# EasyEDA schematic SCH_3Electronic-Trash_2025-03-29.json
TITLE: Sheet_1; REV: 1.0; Date: 2024-07-19; Sheet: 1/1; Drawn By: sahilchess09; Company: Your Company
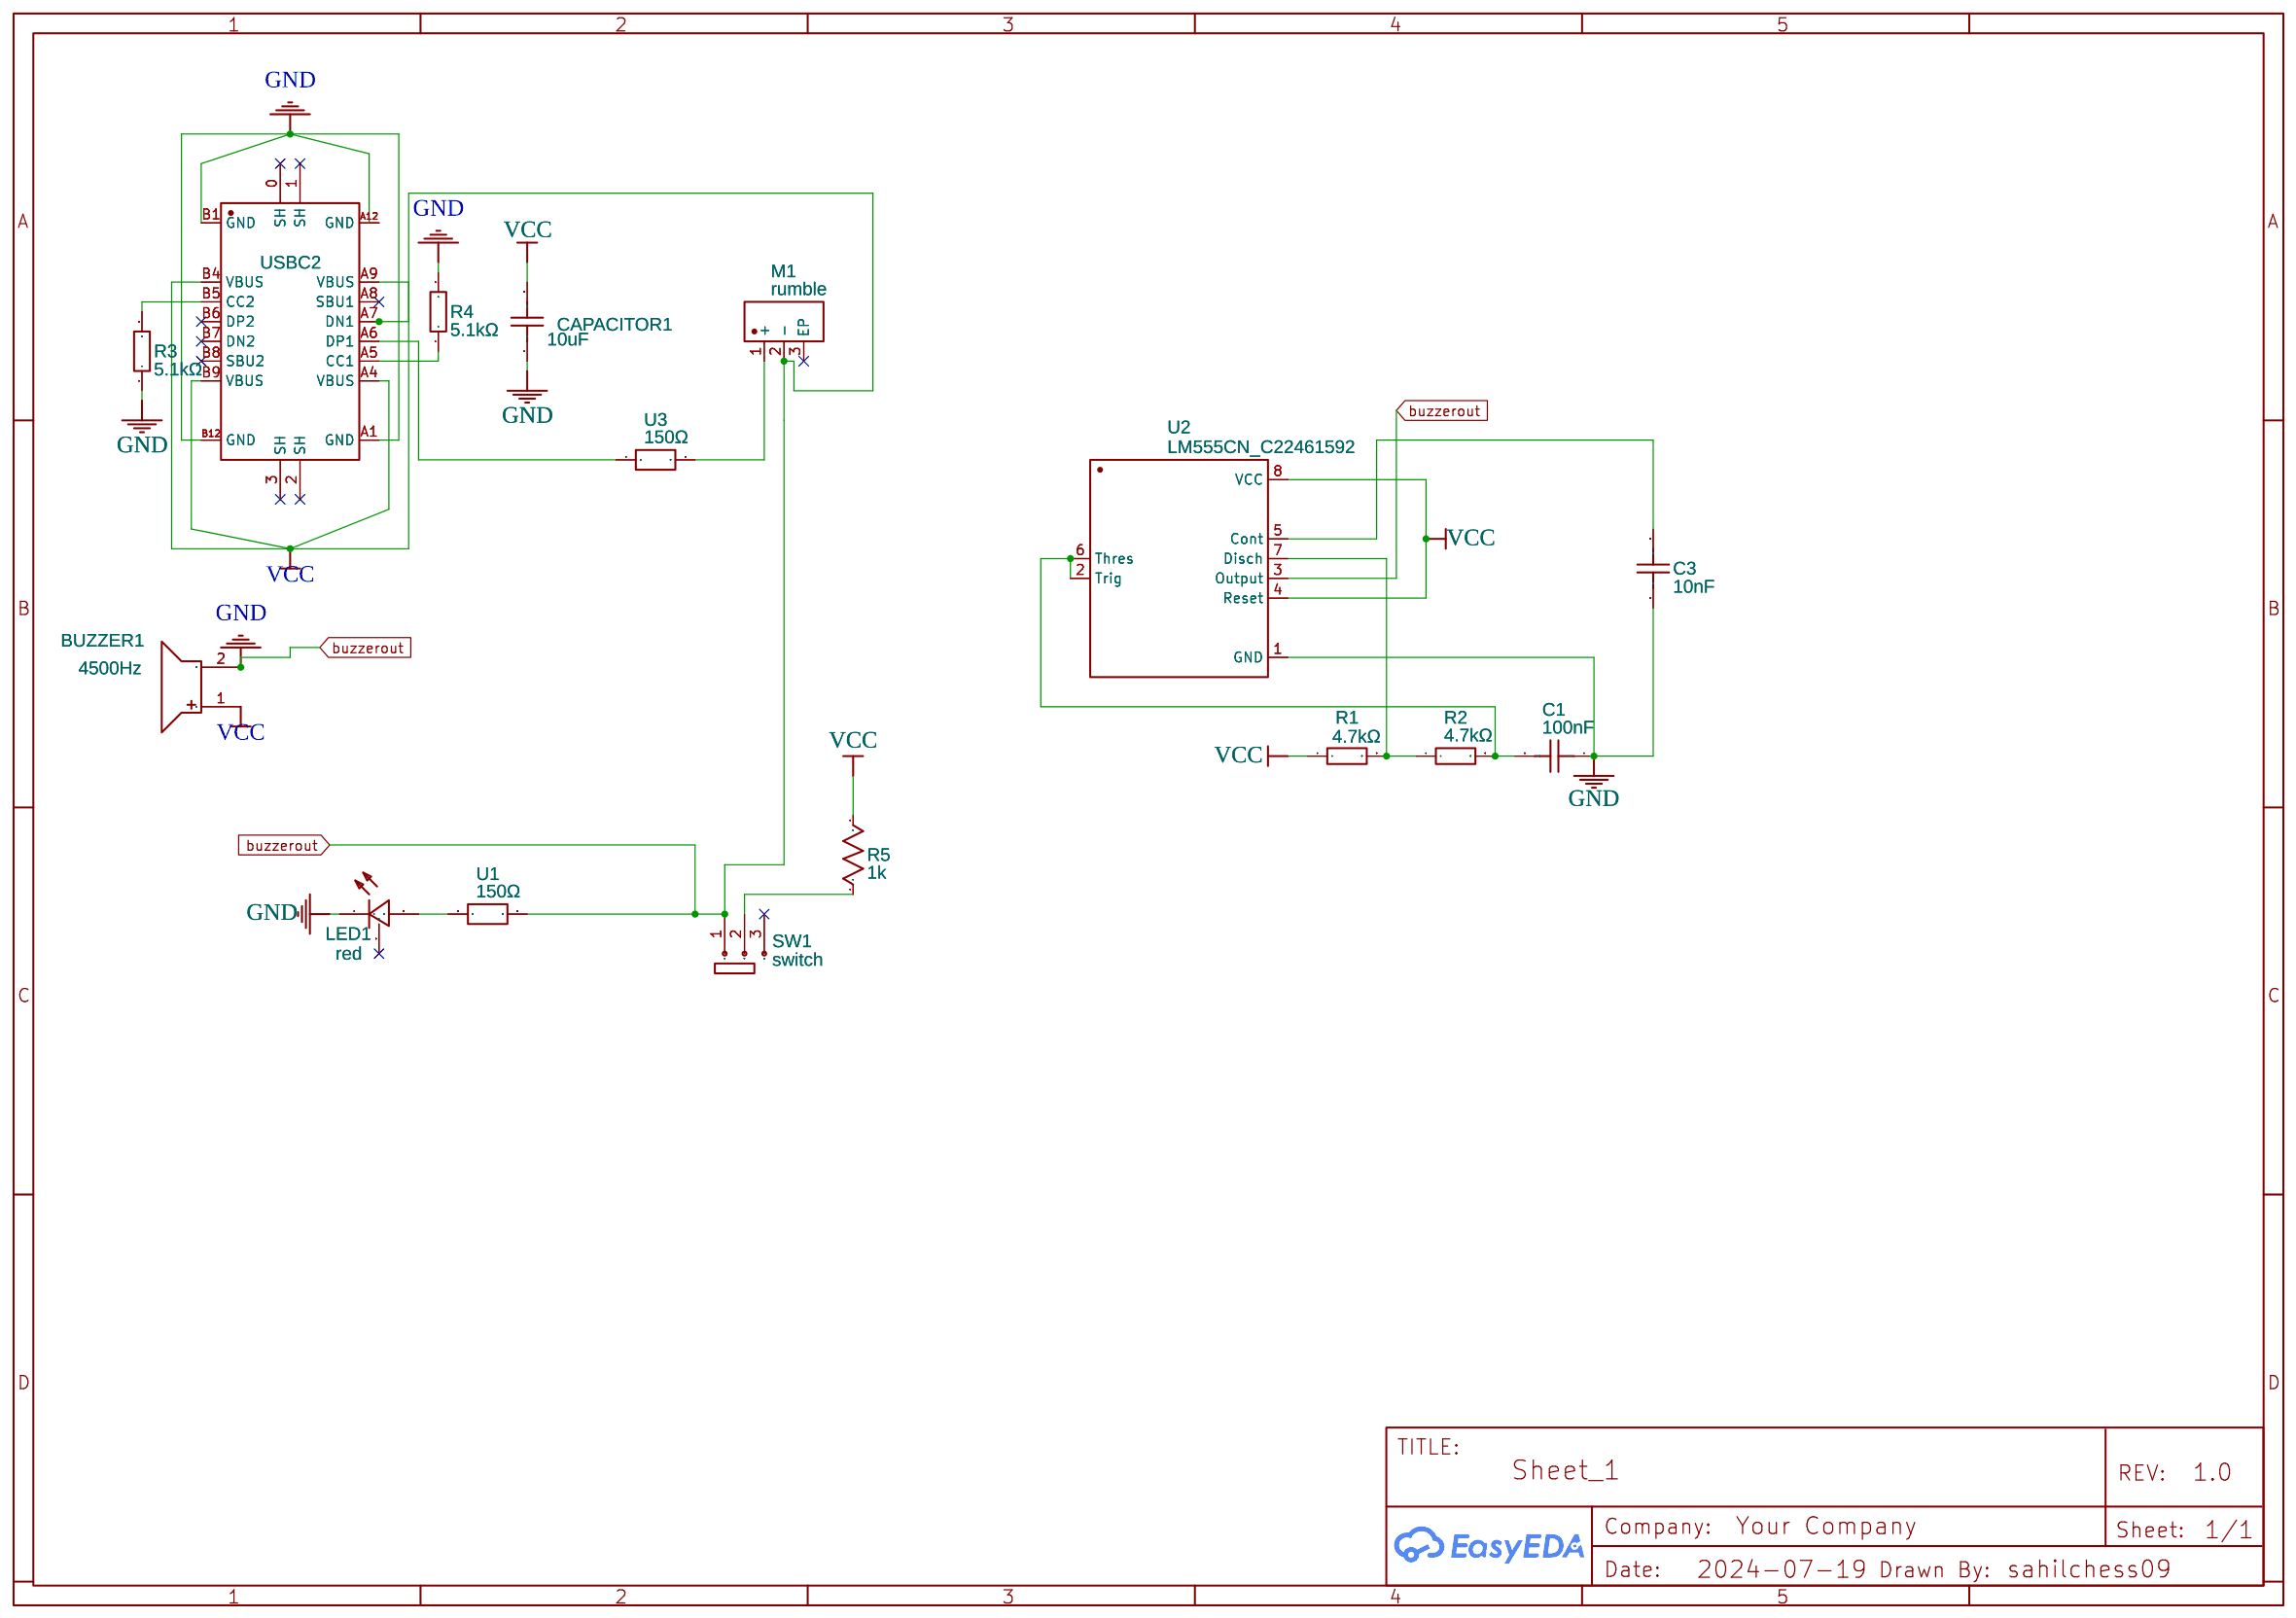
[diagram p0: schematic sheet]

## Parts
BUZZER1  4500Hz  [BUZ-TH_BD14.1-P7.62-D1.0-FD]
C1  100nF  [CAP-TH_L18.0-W6.0-P15.00-D0.8]
C3  10nF  [CAP-TH_L13.0-W5.0-P10.00-D0.6]
CAPACITOR1  10uF  [C0603]
LED1  red  [LED-SMD_3P-L3.2-W1.0-RD_RED]
M1  rumble  [VIBRATING-MOTOR-SMD_3P-C9900001680]
R1  4.7kΩ  [RES-TH_BD2.3-L6.5-P10.50-D0.5]
R2  4.7kΩ  [RES-TH_BD2.3-L6.5-P10.50-D0.5]
R3  5.1kΩ  [R0805]
R4  5.1kΩ  [R0805]
R5  1k  [R0603]
SW1  switch  [SW-TH_K3-1235S-L1]
U1  150Ω  [R0402]
U2  LM555CN_C22461592  [PDIP-8_L9.6-W6.4-P2.54-LS7.6-BL]
U3  150Ω  [R0402]
USBC2  TYPE-C-31-M-12  [USB-C_SMD-TYPE-C-31-M-12]

## Library data of the parts
BUZZER1 = HND-1407B: Contributor: LCSC; Supplier: LCSC; Manufacturer: 华能; Supplier Part: C115184; JLCPCB Part Class: Extended Part
C1 = MPX104K31D2KN15800: Contributor: lcsc; Supplier: LCSC; Supplier Part: C489085; Manufacturer: KNSCHA(科尼盛); JLCPCB Part Class: Extended Part
C3 = B1030630-D-10-3R: Contributor: lcsc; Supplier: LCSC; Supplier Part: C5119335; Manufacturer: GDHY(广东华裕)
CAPACITOR1 = CL10A106KP8NNNC: Supplier: LCSC; Manufacturer: SAMSUNG(三星); Supplier Part: C19702; JLCPCB Part Class: Basic Part
LED1 = TJ-S3210SW5TGLC2R-A5: Contributor: LCSC; Supplier: LCSC; Supplier Part: C273626; Manufacturer: TOGIALED(统佳); JLCPCB Part Class: Extended Part
M1 = Z3OC1T8219731: Contributor: LCSC; Supplier: LCSC; Supplier Part: C2894731; Manufacturer: KOTL(金龙机电); JLCPCB Part Class: Extended Part
R1 R2 = MF1/4W-4.7KΩ±1% T52: Contributor: LCSC; Supplier: LCSC; Supplier Part: C119339; Manufacturer: CCO(千志电子); Manufacturer Part: MF1/4W-4.7KΩ±1% T; JLCPCB Part Class: Extended Part
R3 R4 = RMC08055.1K1%N: Contributor: LCSC; Supplier: LCSC; Supplier Part: C269748; Manufacturer: Tyohm(幸亚电阻); JLCPCB Part Class: Extended Part
R5 = R_0603_US: Contributor: LCEDA_Lib
SW1 = K3-1235S-L1: Contributor: LCSC; Supplier: LCSC; Supplier Part: C223838; Manufacturer: 韩国韩荣; JLCPCB Part Class: Extended Part
U1 U3 = TNPW0402150RBYEP: Supplier: LCSC; Supplier Part: C4103204; Manufacturer: VISHAY(威世); JLCPCB Part Class: Extended Part; Contributor: lcsc
U2 = LM555CN_C22461592: Supplier: LCSC; Supplier Part: C22461592; Manufacturer: HGSEMI(华冠); Manufacturer Part: LM555CN; Contributor: lcsc
USBC2 = TYPE-C-31-M-12: Contributor: LCSC; Supplier: LCSC; Supplier Part: C165948; Manufacturer: 韩国韩荣; JLCPCB Part Class: Extended Part

## Nets
GND: BUZZER1.2 C1.1 C3.1 CAPACITOR1.1 LED1.1 M1.2(-) R3.1 R4.2 SW1.1 U1.2 U2.1(GND) U2.3(Output) USBC2.A1(GND) USBC2.A7(DN1) USBC2.A12(GND) USBC2.B1(GND) USBC2.B12(GND)
VCC: BUZZER1.1 CAPACITOR1.2 R1.1 R5.2 U2.4(Reset) U2.8(VCC) USBC2.A4(VBUS) USBC2.A9(VBUS) USBC2.B4(VBUS) USBC2.B9(VBUS)
Net-(C1-2): C1.2 R2.2 U2.2(Trig) U2.6(Thres)
Net-(C3-2): C3.2 U2.5(Cont)
Net-(LED1-2): LED1.2 U1.1
Net-(M1-1): M1.1(+) U3.2
Net-(R1-2): R1.2 R2.1 U2.7(Disch)
Net-(R3-2): R3.2 USBC2.B5(CC2)
Net-(R4-1): R4.1 USBC2.A5(CC1)
Net-(R5-1): R5.1 SW1.2
Net-(U3-1): U3.1 USBC2.A6(DP1)

Not connected (* = marked no-connect by the designer): LED1 3*; M1 3(EP)*; SW1 3*; USBC2 0(SH)* 1(SH)* 2(SH)* 3(SH)* A8(SBU1)* B6(DP2)* B7(DN2)* B8(SBU2)*
